# Altium schematic sheet DK_GU600E_V10.SchDoc
size A4
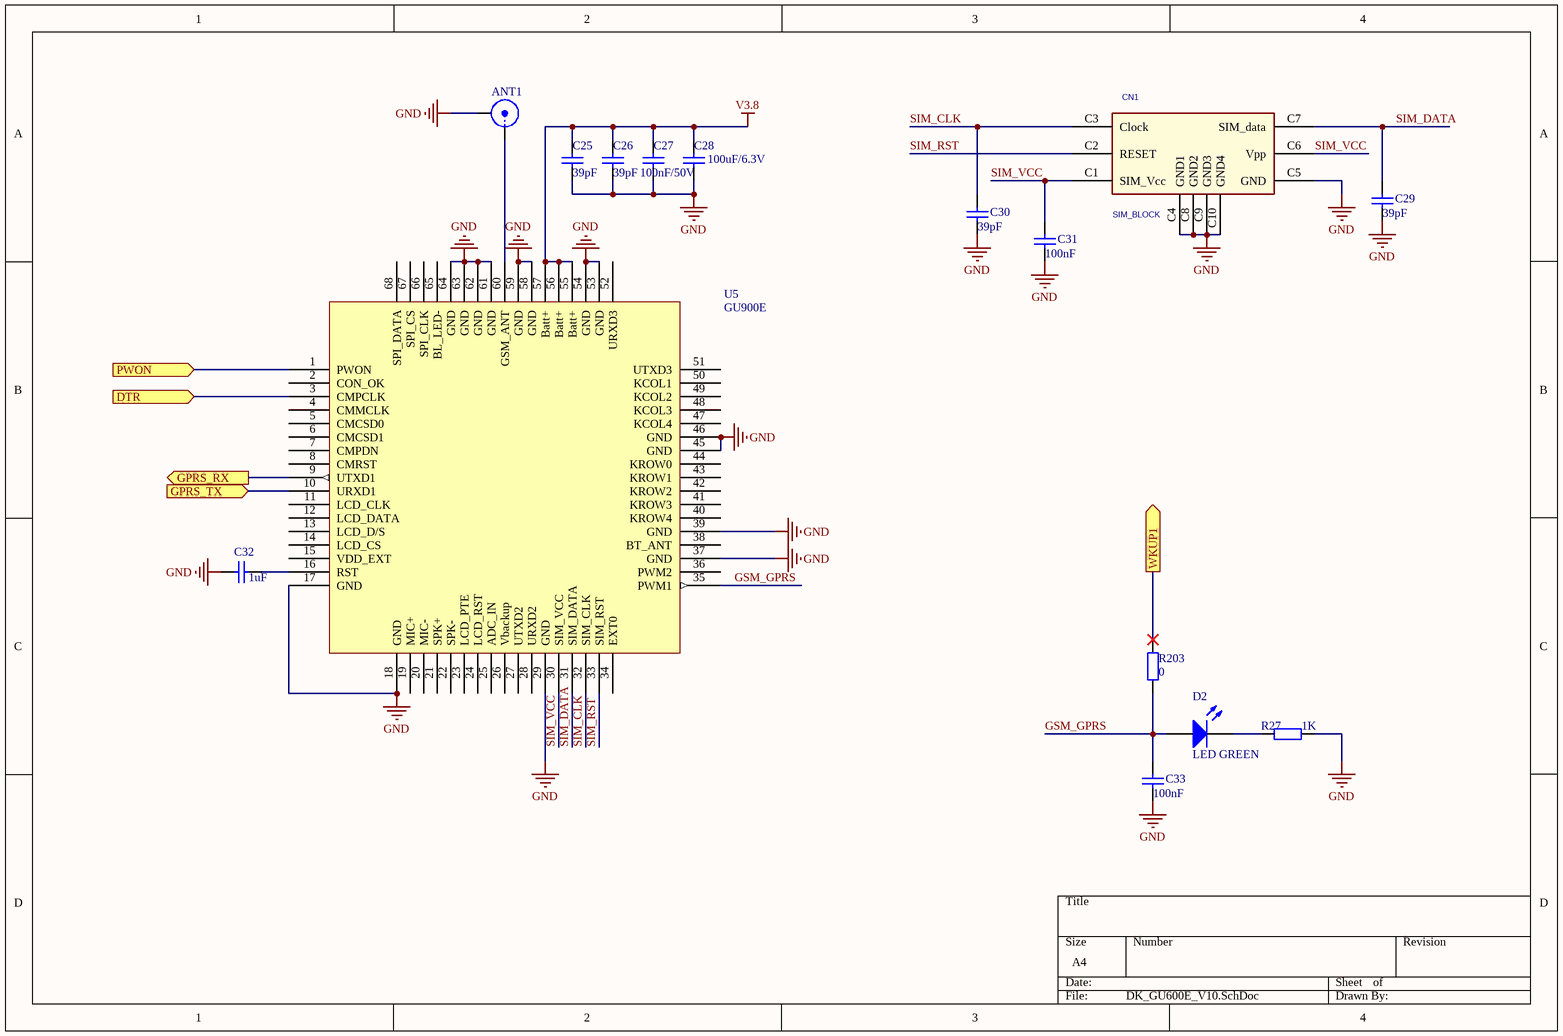
[diagram p0: DK_GU600E_V10.SchDoc]

## Parts
ANT1  SMB  [SMB_V-RJ45]  (value not drawn)
C25  value 39pF  [0603]  (hidden comment: Cap)
C26  value 39pF  [0603]  (hidden comment: Cap)
C27  value 100nF/50V  [0603]  (hidden comment: Cap)
C28  value 100uF/6.3V  [LC-CASE-D_7343]  (hidden comment: Cap)
C29  value 39pF  [0603]  (hidden comment: Cap)
C30  value 39pF  [0603]  (hidden comment: Cap)
C31  value 100nF  [0603]  (hidden comment: Cap)
C32  value 1uF  [0603]  (hidden comment: Cap)
C33  value 100nF  [0603]  (hidden comment: Cap)
CN1  SIM_BLOCK  [SIM_BLOCK]
D2  LED GREEN  [LED0603]
R27  value 1K  [0603]  (hidden comment: Res2)
R203  value 0  [0603]  (hidden comment: Res2)
U5  GU900E  [SIM900-68P]

## Ports
DTR (in), GPRS_RX (out), GPRS_TX (in), PWON (in), WKUP1 (out)

## Nets
GND: ANT1.2(Y) C25.1 C26.1 C27.1 C28.1 C29.1 C30.1 C31.1 C32.1 C33.1 CN1.C4(GND1) CN1.C5(GND) CN1.C8(GND2) CN1.C9(GND3) CN1.C10(GND4) R27.2 U5.17(GND) U5.18(GND) U5.29(GND) U5.37(GND) U5.39(GND) U5.45(GND) U5.46(GND) U5.53(GND) U5.54(GND) U5.58(GND) U5.59(GND) U5.61(GND) U5.62(GND) U5.63(GND) U5.64(GND)
V3.8: C25.2 C26.2 C27.2 C28.2 U5.55(Batt+) U5.56(Batt+) U5.57(Batt+)
DTR: U5.3(CMPCLK) ; port DTR
GPRS_RX: U5.9(UTXD1) ; port GPRS_RX
GPRS_TX: U5.10(URXD1) ; port GPRS_TX
GSM_GPRS: C33.2 D2.1(A) R203.1 U5.35(PWM1)
PWON: U5.1(PWON) ; port PWON
SIM_CLK: C30.2 CN1.C3(Clock) U5.32(SIM_CLK)
SIM_DATA: C29.2 CN1.C7(SIM_data) U5.31(SIM_DATA)
SIM_RST: CN1.C2(RESET) U5.33(SIM_RST)
SIM_VCC: C31.2 CN1.C1(SIM_Vcc) CN1.C6(Vpp) U5.30(SIM_VCC)
WKUP1: R203.2 ; port WKUP1
NetANT1_1: ANT1.1(X) U5.60(GSM_ANT)
NetC32_2: C32.2 U5.16(RST)
NetD2_2: D2.2(K) R27.1

Not connected (* = marked no-connect by the designer): U5 2(CON_OK) 4(CMMCLK) 5(CMCSD0) 6(CMCSD1) 7(CMPDN) 8(CMRST) 11(LCD_CLK) 12(LCD_DATA) 13(LCD_D/S) 14(LCD_CS) 15(VDD_EXT) 19(MIC+) 20(MIC-) 21(SPK+) 22(SPK-) 23(LCD_PTE) 24(LCD_RST) 25(ADC_IN) 26(Vbackup) 27(UTXD2) 28(URXD2) 34(EXT0) 36(PWM2) 38(BT_ANT) 40(KROW4) 41(KROW3) 42(KROW2) 43(KROW1) 44(KROW0) 47(KCOL4) 48(KCOL3) 49(KCOL2) 50(KCOL1) 51(UTXD3) 52(URXD3) 65(BL_LED-) 66(SPI_CLK) 67(SPI_CS) 68(SPI_DATA)

## Library data of the parts
ANT1 = SMB: SMB Straight Connector; LatestRevisionDate: 17-Jul-2002; LatestRevisionNote: Re-released for DXP Platform.; Publisher: Altium Limited
C25-C33 = Cap: Capacitor; Published: 8-Jun-2000; LatestRevisionDate: 17-Jul-2002; LatestRevisionNote: Re-released for DXP Platform.; PackageReference: RAD-0.3; Publisher: Altium Limited; PackageDescription: Radial Cap, Thru-Hole; 2 Leads; 0.3 in Pin Spacing
CN1 = SIM_BLOCK_2
D2 = LED2: Typical RED, GREEN, YELLOW, AMBER GaAs LED; Published: 8-Jun-2000; LatestRevisionDate: 17-Jul-2002; LatestRevisionNote: Re-released for DXP Platform.; PackageVersion: Feb-2002; PackageReference: 3.2X1.6X1.1; Publisher: Altium Limited; PackageDescription: SM LED; 2 Flat Leads
R27 R203 = Res2: Resistor; Published: 8-Jun-2000; LatestRevisionDate: 17-Jul-2002; LatestRevisionNote: Re-released for DXP Platform.; PackageReference: AXIAL-0.4; Publisher: Altium Limited; PackageDescription: Axial Device, Thru-Hole; 2 Leads; 0.4 in Pin Spacing